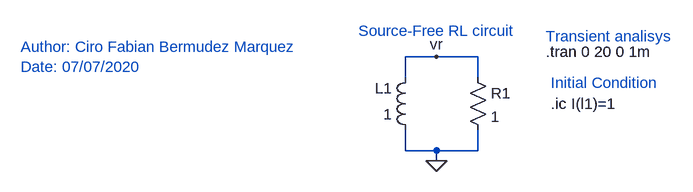
[diagram p0: schematic Source-Free_RL.asc]
Source-Free_RL.asc, the LTspice schematic file:
Version 4
SHEET 1 880 680
WIRE 128 112 80 112
WIRE 192 112 128 112
WIRE 80 144 80 112
WIRE 192 144 192 112
WIRE 80 256 80 224
WIRE 128 256 80 256
WIRE 192 256 192 224
WIRE 192 256 128 256
WIRE 128 272 128 256
FLAG 128 272 0
FLAG 128 112 vr
SYMBOL res 176 128 R0
SYMATTR InstName R1
SYMATTR Value 1
SYMBOL ind 96 240 R180
WINDOW 0 36 80 Left 2
WINDOW 3 36 40 Left 2
SYMATTR InstName L1
SYMATTR Value 1
TEXT 296 104 Left 2 !.tran 0 20 0 1m
TEXT 304 184 Left 2 !.ic I(l1)=1
TEXT 304 152 Left 2 ;Initial Condition
TEXT 8 72 Left 2 ;Source-Free RL circuit
TEXT 296 80 Left 2 ;Transient analisys
TEXT -512 96 Left 2 ;Author: Ciro Fabian Bermudez Marquez\nDate: 07/07/2020

The netlist it stands for:
* Source-Free_RL.asc
R1 vr 0 1
L1 0 vr 1
.tran 0 20 0 1m
.ic I(l1)=1
* Initial Condition
* Source-Free RL circuit
* Transient analisys
* Author: Ciro Fabian Bermudez Marquez
* Date: 07/07/2020
.backanno
.end